# EAGLE schematic attiny45light (EAGLE 9.4.2)
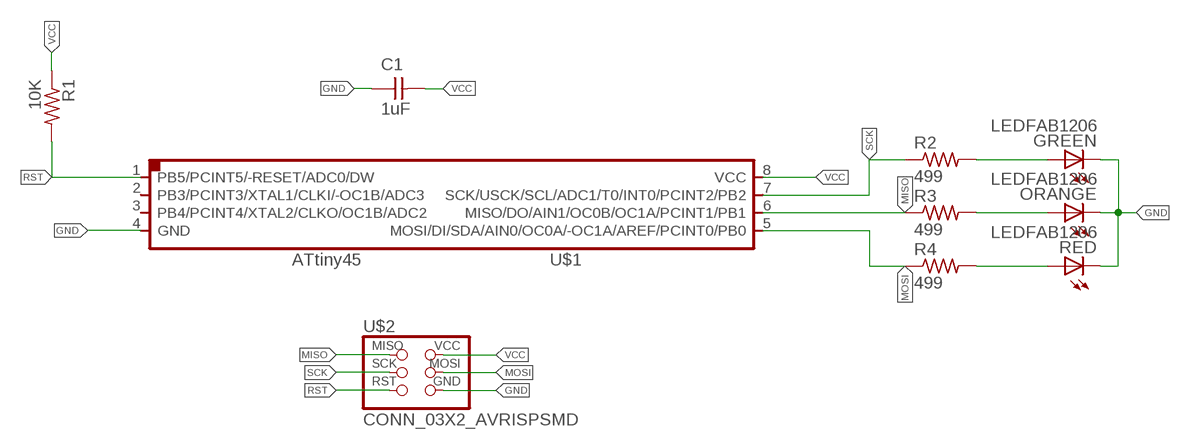
[diagram p0: schematic, sheet 1]

## Parts
C1  1uF  CAP_UNPOLARIZEDFAB  [C1206FAB]
GREEN  LEDFAB1206  [LED1206FAB]
ORANGE  LEDFAB1206  [LED1206FAB]
R1  10K  R1206FAB  [R1206FAB]
R2  499  R1206FAB  [R1206FAB]
R3  499  R1206FAB  [R1206FAB]
R4  499  R1206FAB  [R1206FAB]
RED  LEDFAB1206  [LED1206FAB]
U$1  UC_ATTINY45SI  [SOIC8]
U$2  CONN_03X2_AVRISPSMD  [2X03SMD]

## Nets
GND: C1.1 GREEN.2(C) ORANGE.2(C) RED.2(C) U$1.4(GND) U$2.6(GND)
MISO: R3.1 U$1.6(MISO/DO/AIN1/OC0B/OC1A/PCINT1/PB1) U$2.1(MISO)
MOSI: R4.1 U$1.5(MOSI/DI/SDA/AIN0/OC0A/-OC1A/AREF/PCINT0/PB0) U$2.4(MOSI)
N$4: GREEN.1(A) R2.2
N$5: ORANGE.1(A) R3.2
N$6: R4.2 RED.1(A)
RST: R1.2 U$1.1(PB5/PCINT5/-RESET/ADC0/DW) U$2.5(RST)
SCK: R2.1 U$1.7(SCK/USCK/SCL/ADC1/T0/INT0/PCINT2/PB2) U$2.3(SCK)
VCC: C1.2 R1.1 U$1.8(VCC) U$2.2(VCC)
Unconnected: U$1.2(PB3/PCINT3/XTAL1/CLKI/-OC1B/ADC3) U$1.3(PB4/PCINT4/XTAL2/CLKO/OC1B/ADC2)

## Library data of the parts
C1 = fab:CAP_UNPOLARIZED
GREEN ORANGE RED = fab:LED: LED
R1-R4 = fab:R: Resistor (US Symbol) Variants with postfix FAB are widened to allow the routing of internal traces
U$1 = fab2:UC_ATTINY45
U$2 = fab2:CONN_03X2_AVRISP